# EAGLE design mapleCUx_large_400-001 (EAGLE 9.3.0)
MAPLE-CUx Large Version
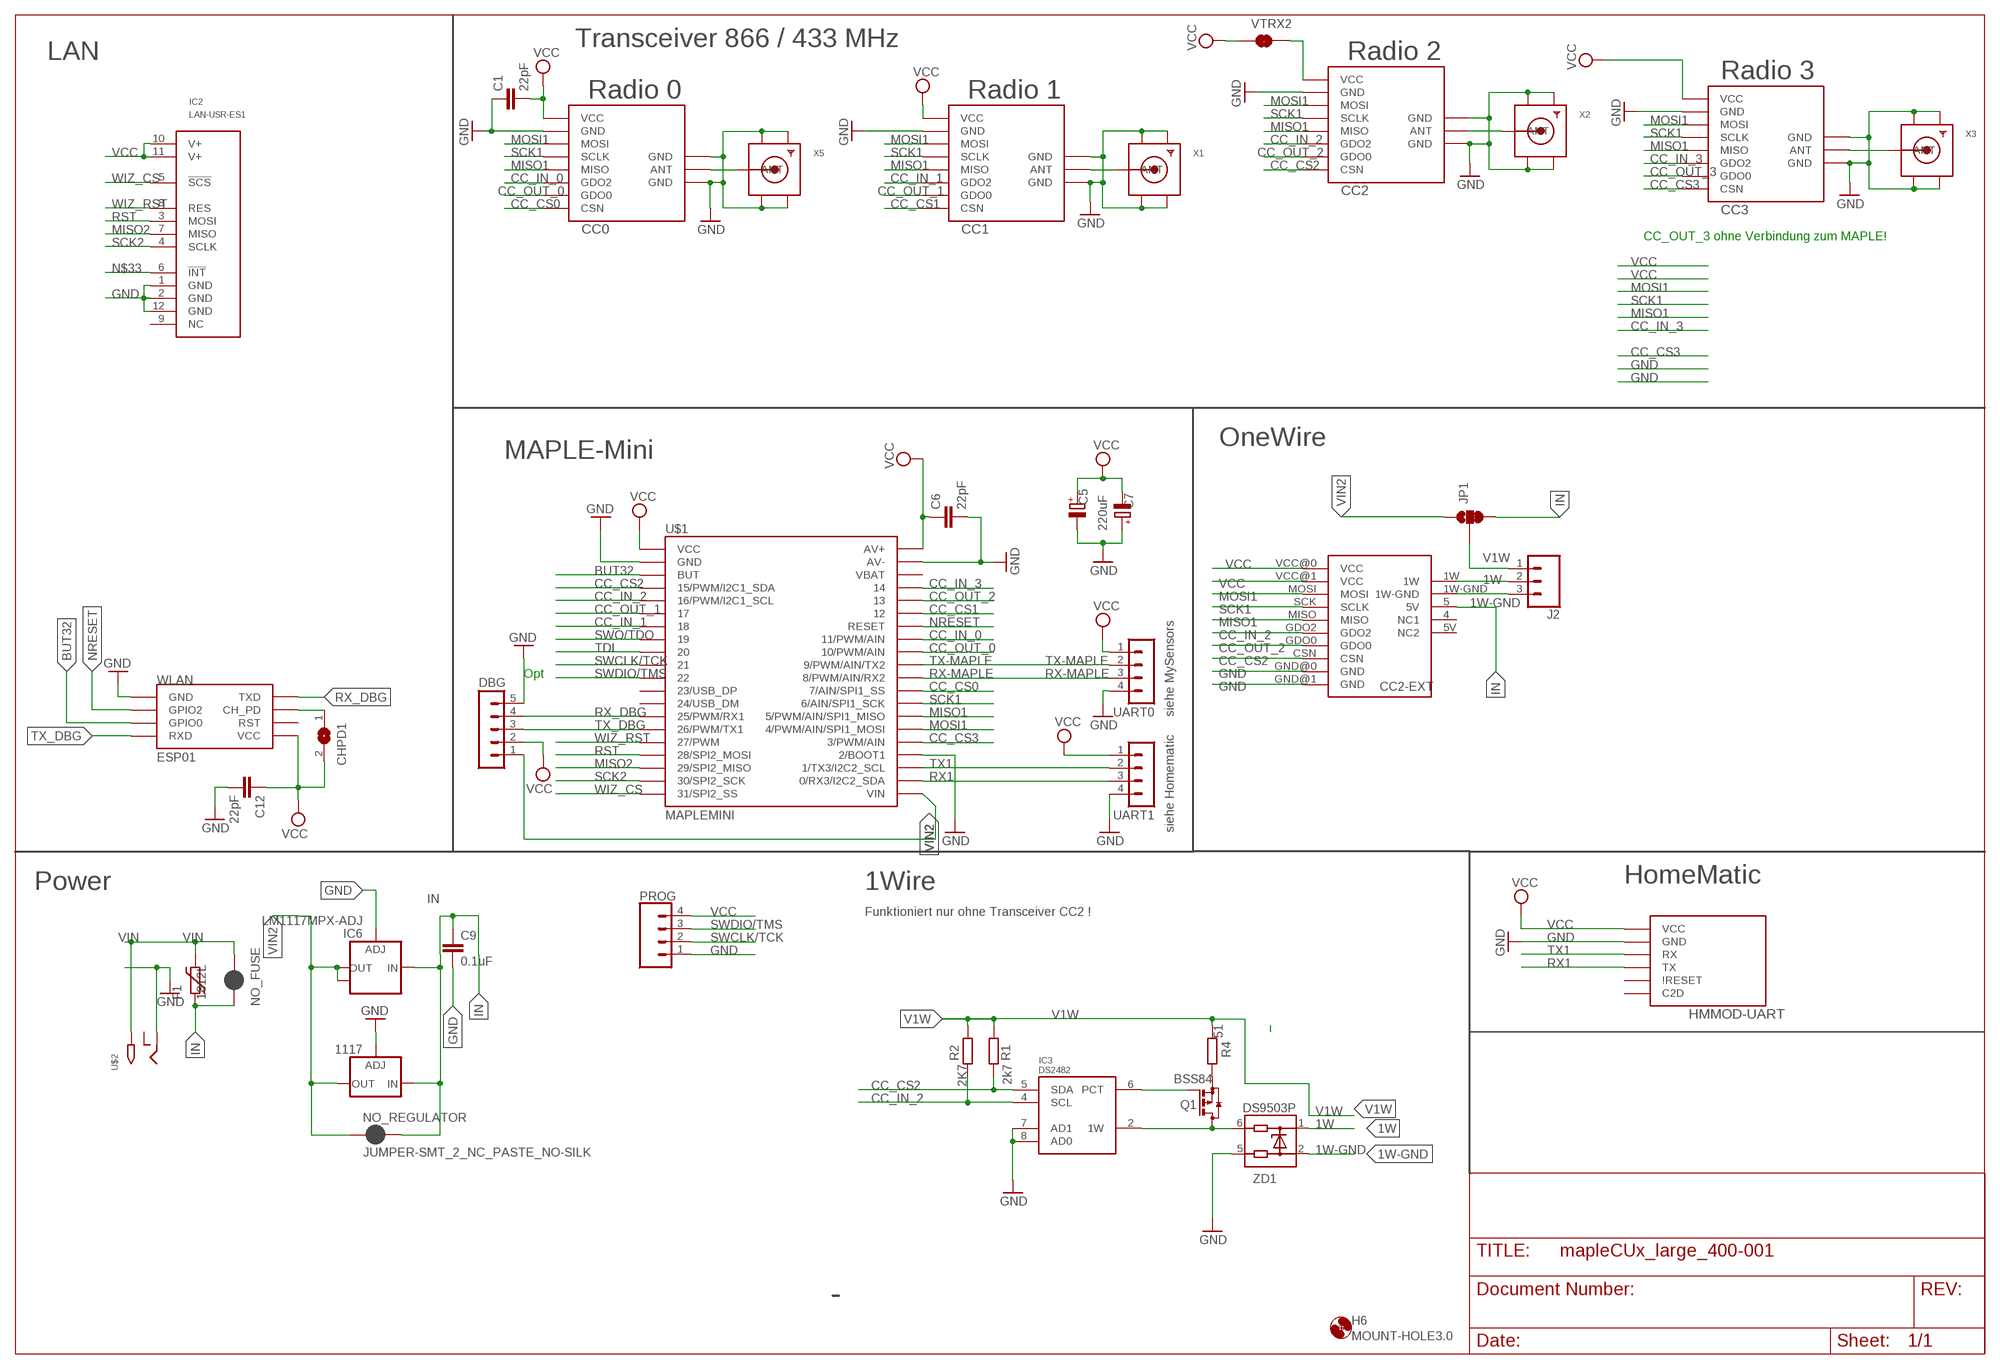
[diagram p0: schematic, sheet 1]

## Parts
1117  LD117ADT50TR  [DPACK]
C1  22pF  C-EUC0805  [C0805]
C5  220uF  CPOL-EUE5-8.5  [E5-8,5]
C6  22pF  C-EUC0805  [C0805]
C7  CPOL-EUSMCE  [SMC_E]
C9  0.1uF  C-EUC1206  [C1206]
C12  22pF  C-EUC0805  [C0805]
CC0  CC1101  CC1101_MODULE1SMD  [CC1101_MODULE1_SMD]
CC1  CC1101_MODULE1SMD  [CC1101_MODULE1_SMD]
CC2  CC1101_MODULE1SMD  [CC1101_MODULE1_SMD]
CC2-EXT  ONEWIRE-MODULE  [ONEWIRE_CC1101_MODULE3_DIL]
CC3  CC1101_MODULE1SMD  [CC1101_MODULE1_SMD]
CHPD1  SJ  [SJ]
DBG  MA05-1  [MA05-1]
F1  1812L  [1812L]
H6  MOUNT-HOLE3.0  [3,0]
HMMOD-UART  HM-MOD-UARTDIL  [HM-MOD-UART-DIL]
IC2  LAN-USR-ES1  [USR-ES1]
IC3  DS2482  DS2482-100S  [SO08]
IC6  LM1117MPX-ADJ  [SOT223]
J2  CONN_03LONGPADS  [1X03_LONGPADS]
JP1  JUMPER-SMT_3_1-NC_TRACE_SILK  [SMT-JUMPER_3_1-NC_TRACE_SILK]
NO_FUSE  JUMPER-SMT_2_NC_PASTE_NO-SILK  [SMT-JUMPER_2_NC_PASTE_NO-SILK]
NO_REGULATOR  JUMPER-SMT_2_NC_PASTE_NO-SILK  [SMT-JUMPER_2_NC_PASTE_NO-SILK]
PROG  CONN_04LOCK  [1X04_LOCK]
Q1  BSS84  [SOT23]
R1  2k7  R-EU_R0805  [R0805]
R2  2K7  R-EU_R0805  [R0805]
R4  51  R-EU_R0805  [R0805]
U$1  MAPLEMINI  [20-DIP]
U$2  2.1MMJACKTHM  [PJ-102A]
UART0  MA04-1  [MA04-1]
UART1  MA04-1  [MA04-1]
VTRX2  JUMPER-SMT_2_NC_TRACE_SILK  [SMT-JUMPER_2_NC_TRACE_SILK]
WLAN  ESP01  [ESP01]
X1  SMACONNECTOR_EDGE  [SMA_EDGELAUNCH]
X2  SMACONNECTOR_EDGE  [SMA_EDGELAUNCH]
X3  SMACONNECTOR_EDGE  [SMA_EDGELAUNCH]
X5  SMACONNECTOR_EDGE  [SMA_EDGELAUNCH]
ZD1  DS9503P  [TSOC6]

## Nets
1W: CC2-EXT.1W J2.2 ZD1.1
1W-GND: CC2-EXT.1W-GND J2.3 ZD1.2
ANT0: CC0.ANT X5.P(ANT)
ANT1: CC1.ANT X1.P(ANT)
ANT2: CC2.ANT X2.P(ANT)
ANT3: CC3.ANT X3.P(ANT)
BUT32: U$1.3(BUT) WLAN.GPIO0
CC_CS0: CC0.CSN U$1.29(7/AIN/SPI1_SS)
CC_CS1: CC1.CSN U$1.35
CC_CS2: CC2-EXT.CSN CC2.CSN IC3.5(SDA) R1.2 U$1.4(15/PWM/I2C1_SDA)
CC_CS3: CC3.CSN U$1.25(3/PWM/AIN)
CC_IN_0: CC0.GDO2 U$1.33(11/PWM/AIN)
CC_IN_1: CC1.GDO2 U$1.7
CC_IN_2: CC2-EXT.GDO2 CC2.GDO2 IC3.4(SCL) R2.2 U$1.5(16/PWM/I2C1_SCL)
CC_IN_3: CC3.GDO2 U$1.37
CC_OUT_0: CC0.GDO0 U$1.32(10/PWM/AIN)
CC_OUT_1: CC1.GDO0 U$1.6
CC_OUT_2: CC2-EXT.GDO0 CC2.GDO0 U$1.36
CC_OUT_3: CC3.GDO0
GND [Power]: 1117.1(ADJ) C1.1 C5.- C6.2 C7.+ C9.2 C12.2 CC0.GND@0(GND) CC0.GND@1(GND) CC0.GND@2(GND) CC1.GND@0(GND) CC1.GND@1(GND) CC1.GND@2(GND) CC2-EXT.GND@0(GND) CC2-EXT.GND@1(GND) CC2.GND@0(GND) CC2.GND@1(GND) CC2.GND@2(GND) CC3.GND@0(GND) CC3.GND@1(GND) CC3.GND@2(GND) DBG.5 HMMOD-UART.2(GND) IC2.1(GND) IC2.2(GND) IC2.12(GND) IC3.7(AD1) IC3.8(AD0) IC6.1(ADJ) PROG.1 U$1.2(GND) U$1.24(2/BOOT1) U$1.39(AV-) U$2.RING UART0.4 UART1.4 WLAN.GND X1.GND@1(GND4) X1.GND@2(GND3) X1.GND@3(GND2) X1.GND@4(GND1) X2.GND@1(GND4) X2.GND@2(GND3) X2.GND@3(GND2) X2.GND@4(GND1) X3.GND@1(GND4) X3.GND@2(GND3) X3.GND@3(GND2) X3.GND@4(GND1) X5.GND@1(GND4) X5.GND@2(GND3) X5.GND@3(GND2) X5.GND@4(GND1) ZD1.5
IN [Power]: 1117.3(IN) C9.1 CC2-EXT.5(5V) F1.P$1 IC6.3(IN) JP1.3 NO_FUSE.1 NO_REGULATOR.2
MISO1: CC0.MISO CC1.MISO CC2-EXT.MISO CC2.MISO CC3.MISO U$1.27(5/PWM/AIN/SPI1_MISO)
MISO2: IC2.7(MISO) U$1.18(29/SPI2_MISO)
MOSI1: CC0.MOSI CC1.MOSI CC2-EXT.MOSI CC2.MOSI CC3.MOSI U$1.26(4/PWM/AIN/SPI1_MOSI)
N$1 [Power]: CC2.VCC VTRX2.2
N$2: CHPD1.1 WLAN.CH_PD
N$33: IC2.6(!INT!)
N$47: IC3.6(PCT) Q1.1(G)
N$48: IC3.2(1W) Q1.3(D) ZD1.6
N$52: Q1.2(S) R4.1
NRESET: U$1.34(RESET) WLAN.GPIO2
RST: IC2.3(MOSI) U$1.17(28/SPI2_MOSI)
RX1: HMMOD-UART.5(TX) U$1.22(0/RX3/I2C2_SDA) UART1.3
RX-MAPLE: U$1.30(8/PWM/AIN/RX2) UART0.3
RX_DBG: DBG.4 U$1.14(25/PWM/RX1) WLAN.TX(TXD)
SCK1: CC0.SCLK CC1.SCLK CC2-EXT.SCK(SCLK) CC2.SCLK CC3.SCLK U$1.28(6/AIN/SPI1_SCK)
SCK2: IC2.4(SCLK) U$1.19(30/SPI2_SCK)
SWCLK/TCK: PROG.2 U$1.10
SWDIO/TMS: PROG.3 U$1.11
SWO/TDO: U$1.8
TDI: U$1.9
TX1: HMMOD-UART.6(RX) U$1.23(1/TX3/I2C2_SCL) UART1.2
TX-MAPLE: U$1.31(9/PWM/AIN/TX2) UART0.2
TX_DBG: DBG.3 U$1.15(26/PWM/TX1) WLAN.RX(RXD)
V1W [Power]: J2.1 JP1.2 R1.1 R2.1 R4.2
VCC [Power]: C1.2 C5.+ C6.1 C7.- C12.1 CC0.VCC CC1.VCC CC2-EXT.VCC@0(VCC) CC2-EXT.VCC@1(VCC) CC3.VCC CHPD1.2 DBG.2 HMMOD-UART.1(VCC) IC2.10(V+) IC2.11(V+) PROG.4 U$1.1(VCC) U$1.40(AV+) UART0.1 UART1.1 VTRX2.1 WLAN.VCC
VIN [Power]: F1.P$2 NO_FUSE.2 U$2.TIP
VIN2 [Power]: 1117.4(OUT) DBG.1 IC6.2(OUT) IC6.TAB(OUT1) JP1.1 NO_REGULATOR.1 U$1.21(VIN)
WIZ_CS: IC2.5(!SCS!) U$1.20(31/SPI2_SS)
WIZ_RST: IC2.8(RES) U$1.16(27/PWM)
Unconnected: CC2-EXT.4(NC1) CC2-EXT.5V(NC2) HMMOD-UART.3(C2D) HMMOD-UART.4(\!RESET) IC2.9(NC) U$1.12(23/USB_DP) U$1.13(24/USB_DM) U$1.38(VBAT) U$2.RING_SW WLAN.RST

## Notes on the sheet
- Transceiver 866 / 433 MHz
- LAN | Radio 2
- Radio 3
- Radio 0 | Radio 1
- CC_OUT_3 ohne Verbindung zum MAPLE!
- OneWire
- MAPLE-Mini
- Opt
- siehe MySensors
- siehe Homematic
- Power | 1Wire | HomeMatic
- Funktioniert nur ohne Transceiver CC2 !

## Power pins joined to a net without a drawn wire
GND: IC3.3(GND)
V1W: IC3.1(VDD)

## Library data of the parts
1117 = v-reg:LD117A?*: Low drop fixed and adjustable positive voltage regulators 1 A Source: http://www.st.com/stonline/products/literature/ds/7194/ld1117axx.pdf
C1 C6 C9 C12 = rcl:C-EU: CAPACITOR, European symbol
C5 = rcl:CPOL-EU: POLARIZED CAPACITOR, European symbol
C7 = rcl:CPOL-EU: POLARIZED CAPACITOR, European symbol; SPICEPREFIX: C
CC0 CC1-CC3 = wireless:CC1101_MODULE1: CC1101 wireless module for 433/868 MHz (sold from Aliexpress). DIL version for mounting with pin header (and SMD soldering) and SMD only variant available.
CC2-EXT = CC1101:ONEWIRE-MODULE
CHPD1 = jumper:SJ: SMD solder JUMPER
DBG = con-lstb:MA05-1: PIN HEADER; OC_FARNELL: unknown; OC_NEWARK: unknown
F1 = ptc-littlefuse:1812L
H6 = holes:MOUNT-HOLE: MOUNTING HOLE with drill center marker
HMMOD-UART = wireless:HM-MOD-UART: eQ3 HM-MOD-UART-AW-SH2 wireless module for 868 MHz. DIL version for mounting with pin header (antenna upwards) and SMD variant available (antenna downwards).
IC2 = Martin-Communication:LAN-USR-ES1
IC3 = 1wire:DS2482-100: I2C to 1-Wire Host Adapter/Line Driver This device is a onewire host and I2C interface in one chip. It provides the complete DC/AC requirements for onewire communication, including overdrive speed mode, but, unlike the DS2480B chip, no 12V EPROM programming. Notes: For overdrive speed and 5V EEPROM programming, an external active pullup circuit must be connected to the 1W, VDD and PCT pin. See the datasheet for details. The lower two I2C adress bits of the chip can be selected by external pins, so up to 4 chips may be connected to the same I2C bus. Author: Orginal device and description from Giovanni Varasano <giovanni.varasano@fastwebnet.it> Improved by Jan Kandziora <jjj@gmx.de>
IC6 = lm1117:LM1117MPX-ADJ
J2 = SparkFun-Connectors:CONN_03: Multi connection point. Often used as Generic Header-pin footprint for 0.1 inch spaced/style header connections On any of the 0.1 inch spaced packages, you can populate with these: Break Away Headers - Straight <https://www.sparkfun.com/products/116> (PRT-00116) Break Away Male Headers - Right Angle <https://www.sparkfun.com/products/553> (PRT-00553) Female Headers <https://www.sparkfun.com/products/115> (PRT-00115) Break Away Headers - Machine Pin <https://www.sparkfun.com/products/117> (PRT-00117) Break Away Female Headers - Swiss Machine Pin <https://www.sparkfun.com/products/743> (PRT-00743) Stackable Header - 3 Pin (Female, 0.1") <https://www.sparkfun.com/products/13875> (PRT-13875) For SCREWTERMINALS and SPRING TERMINALS visit here: Screw Terimnals on SparkFun.com <https://www.sparkfun.com/search/results?term=Screw+Terminals> (5mm/3.5mm/2.54mm spacing) This device is also useful as a general connection point to wire up your design to another part of your project. Our various solder wires solder well into these plated through hole pads. Hook-Up Wire - Assortment (Stranded, 22 AWG) <https://www.sparkfun.com/products/11375> (PRT-11375) Hook-Up Wire - Assortment (Solid Core, 22 AWG) <https://www.sparkfun.com/products/11367> (PRT-11367) View the entire wire category on our website here <https://www.sparkfun.com/categories/141> Special notes: Molex polarized connector foot print use with SKU : PRT-08232 with associated crimp pins and housings.
JP1 = SparkFun-Jumpers:JUMPER-SMT_3_1-NC_TRACE: Normally closed trace jumper (1 of 2 connections) This jumper has a trace between two pads so it's normally closed (NC). The other connection is normally open (NO). Use a razor knife to open the connection. For best results follow the IPC guidelines for cutting traces: Cutout at least 0.063 mm (0.005 in). Remove all loose material to clean up the cut area. Seal the cut with an approved epoxy. Reapply solder to reclose the connection, or to close the NO connection.
NO_FUSE NO_REGULATOR = SparkFun-Jumpers:JUMPER-SMT_2_NC_PASTE: Normally closed solder jumper This jumper has an aperture in the stencil to allow solder paste to bridge the split in the wire so it's normally closed (NC). Wick off the solder to open the connection. Reapply solder to reclose the connection.
PROG = SparkFun-Connectors:CONN_04: Multi connection point. Often used as Generic Header-pin footprint for 0.1 inch spaced/style header connections On any of the 0.1 inch spaced packages, you can populate with these: Break Away Headers - Straight <https://www.sparkfun.com/products/116> (PRT-00116) Break Away Male Headers - Right Angle <https://www.sparkfun.com/products/553> (PRT-00553) Female Headers <https://www.sparkfun.com/products/115> (PRT-00115) Break Away Headers - Machine Pin <https://www.sparkfun.com/products/117> (PRT-00117) Break Away Female Headers - Swiss Machine Pin <https://www.sparkfun.com/products/743> (PRT-00743) For SCREWTERMINALS and SPRING TERMINALS visit here: Screw Terimnals on SparkFun.com <https://www.sparkfun.com/search/results?term=Screw+Terminals> (5mm/3.5mm/2.54mm spacing) This device is also useful as a general connection point to wire up your design to another part of your project. Our various solder wires solder well into these plated through hole pads. Hook-Up Wire - Assortment (Stranded, 22 AWG) <https://www.sparkfun.com/products/11375> (PRT-11375) Hook-Up Wire - Assortment (Solid Core, 22 AWG) <https://www.sparkfun.com/products/11367> (PRT-11367) View the entire wire category on our website here <https://www.sparkfun.com/categories/141> Special notes: Molex polarized connector foot print use with SKU : PRT-08231 with associated crimp pins and housings. 1MM SMD Version SKU: PRT-10208; PROD_ID: CONN-09696
Q1 = transistor-small-signal:BSS84: P-CHANNEL MOS FET
R1 R2 R4 = rcl:R-EU_: RESISTOR, European symbol
U$1 = maplemini-small:MAPLEMINI
U$2 = adafruit:2.1MMJACK: 2.1mm x 5.5mm THM DC jack with internal switch. Digikey part #PJ-102A, 4UCON part #05537 2.1mm x 5.5mm SMT DC jack with internal switch. Digikey part #PJ-002A-SMT, 4UCON part #03267 By microbuilder.eu & adafruit.com
UART0 UART1 = con-lstb:MA04-1: PIN HEADER; OC_FARNELL: unknown; OC_NEWARK: unknown
VTRX2 = SparkFun-Jumpers:JUMPER-SMT_2_NC_TRACE: Normally closed trace jumper This jumper has a trace between two pads so it's normally closed (NC). Use a razor knife to open the connection. For best results follow the IPC guidelines for cutting traces: Cutout at least 0.063 mm (0.005 in). Remove all loose material to clean up the cut area. Seal the cut with an approved epoxy. Reapply solder to reclose the connection.
WLAN = esp8266modules:ESP01: ESP8266 Wifi module 01
X1-X3 X5 = adafruit:SMACONNECTOR: SMA Connector 90° DIP SMA Connector, 50 Ohm (4UConnector: 07259)
ZD1 = 1wire:DS9503: ESD Protection Diode with Resistors This ESD protection diode is designed especially for onewire host interfaces. Unlike the DS9502, it has two additional 5Ohm resitors in the 1W and GND line. Pin 5 and 6 have to be connected to the host side, pin 1 und 2 to the network side. The 1W line is through pin 1 and 6, the GND line is through pin 2 and 5. Author: Jan Kandziora <jjj@gmx.de>

## Net classes
0 default: width 0.305 mm
1 Power: width 0.61 mm

## Board
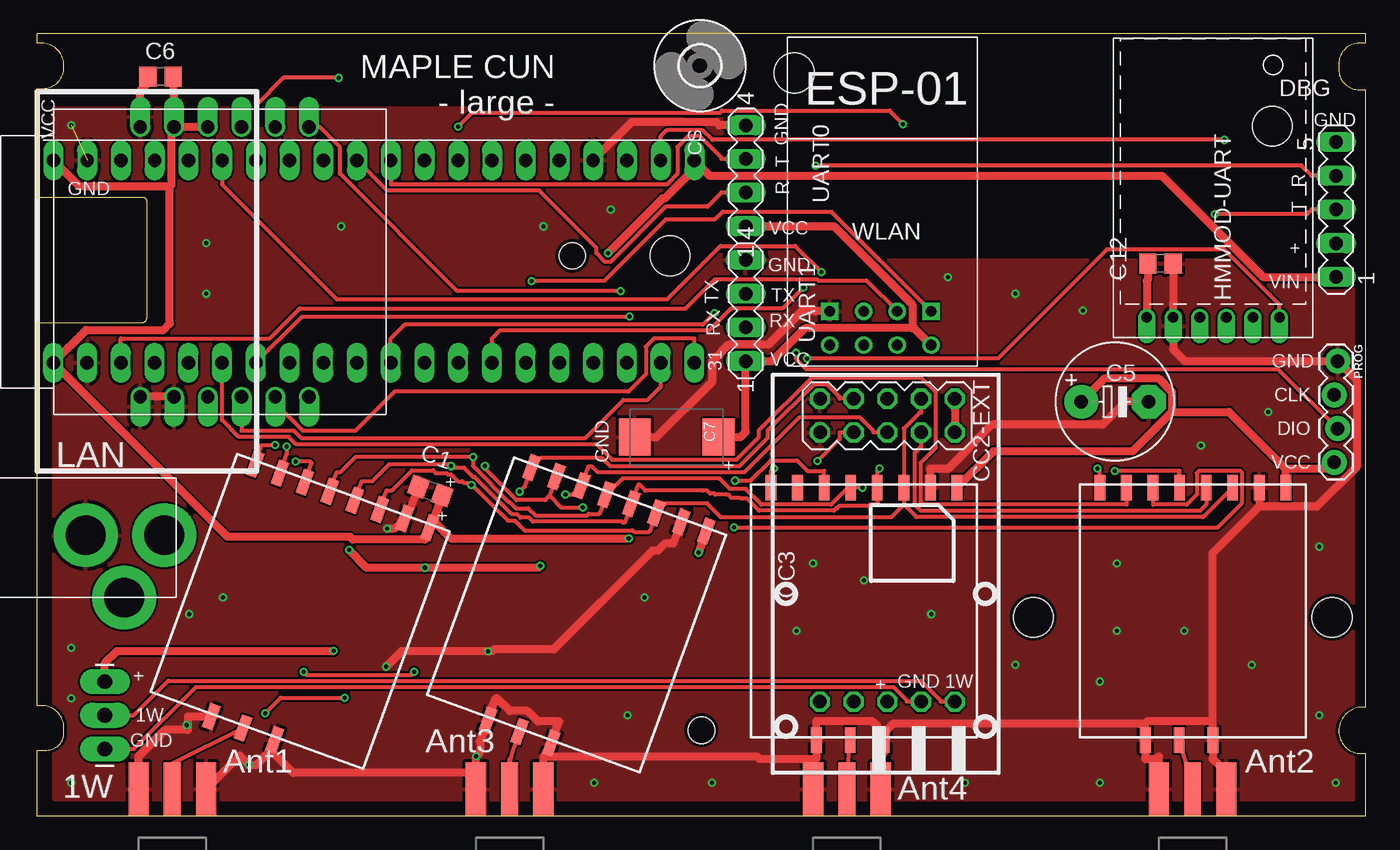
[diagram p1: board, top side]
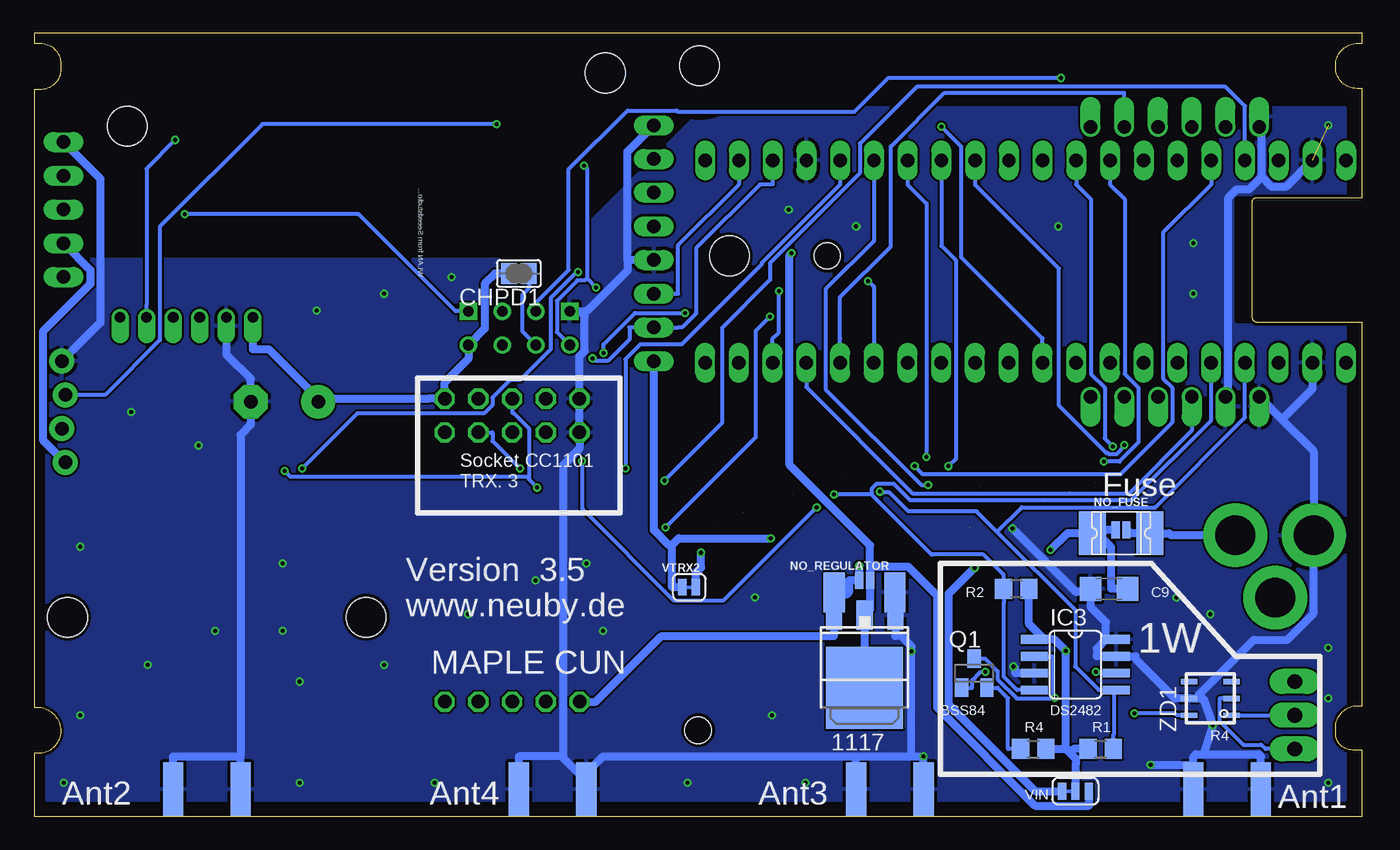
[diagram p2: board, bottom side, seen from below]

Size 100 x 59 mm. Coordinates in mm from the lower left corner, seen from the top.
Outline: 0,0 0,5 0.71,5 arc90 2,6.29 2,6.67 arc90 0.32,8.35 0,8.35 0,37.21 7.89,37.21 arc90 8.26,37.58 8.26,46.32 arc90 7.97,46.61 0,46.61 0,54.83 0.39,54.83 arc90 2,56.44 2,56.57 arc90 0.33,58.24 0,58.24 0,59 100,59 100,58.24 99.54,58.24 arc90 98,56.7 98,56.41 arc90 99.41,54.75 100,54.75 100,8.24 99.8,8.24 arc90 98,6.44 arc90 99.69,4.75 100,4.75 100,0 0,0
Copper layers (1*16): Top 0.035mm / dielectric 1.5mm / Bottom 0.035mm
Design rules "SeeedStudio_2layer_DRU_no_angle_20140221": minimum track width 6mil, minimum drill 12mil, track to track 6mil, track to pad 6mil, pad to pad 6mil, via to via 6mil, smd to smd 0mil, copper to edge 10mil, drill to drill 10mil, minimum pad ring 10mil, minimum via ring 6mil, stop-mask expansion 2mil, vias tented up to drill 100mil, thermal gap 10mil
Holes 2 mm at 50,6.5 40.28,42.23
Holes 3 mm at 47.65,42.23 93,52 57,56 75,15 97.5,15
tRestrict: area 0,37.3 to 9.4,46.5
bRestrict: area 0,37.3 to 9.4,46.5

### Footprints (pad centres in the part's own frame; a part is rotated, then mirrored left to right if it is on the bottom)
DPACK = smd 1.6 x 3: 1 -2.28,-4.8; 3 2.28,-4.8 | smd 5.8 x 6.2: 4 0,2.38
C0805 = smd 1.3 x 1.5: 1 -0.95,0; 2 0.95,0
E5-8,5 = drill 1.016 pad 2.54: + -2.54,0 | drill 1.016 pad 2.54 octagon: - 2.54,0
SMC_E = smd 2.4 x 2.8: + -3.15,0; - 3.15,0
C1206 = smd 1.6 x 1.8: 1 -1.4,0; 2 1.4,0
CC1101_MODULE1_SMD = smd 1.93 x 0.813: ANT 19,5.96; CSN 0,0; GDO0 0,2; GDO2 0,4; GND@0 0,12; GND@1 19,8.5; GND@2 19,3.42; MISO 0,6; MOSI 0,10; SCLK 0,8; VCC 0,14
ONEWIRE_CC1101_MODULE3_DIL = drill 1.016 octagon: 1W 24.638,13.716; 1W-GND 24.638,11.176; 4 24.638,6.096; 5 24.638,3.556; 5V 24.638,8.636; CSN 1.81,6.1; GDO0 4.35,6.1; GDO2 4.35,8.64; GND@0 1.81,3.56; GND@1 4.35,3.56; MISO 1.81,8.64; MOSI 1.81,11.18; SCK 4.35,11.18; VCC@0 1.81,13.72; VCC@1 4.35,13.72
SJ = smd 1.168 x 1.6: 1 -0.762,0; 2 0.762,0
MA05-1 = drill 1.016 long: 1 -5.08,0; 2 -2.54,0; 3 0,0; 4 2.54,0; 5 5.08,0
1812L = smd 2.03 x 3.3: P$1 -2.16,0; P$2 2.16,0
3,0 = hole 3: 0,0
HM-MOD-UART-DIL = drill 0.8 offset: 1 0,12; 2 0,10; 3 0,8; 4 0,6; 5 0,4; 6 0,2
USR-ES1 = drill 1 pad 1.35 offset: 1 -10.16,5.715; 2 -10.16,3.175; 3 -10.16,0.635; 4 -10.16,-1.905; 5 -10.16,-4.445; 6 -10.16,-6.985; 7 10.16,-6.985; 8 10.16,-4.445; 9 10.16,-1.905; 10 10.16,0.635; 11 10.16,3.175; 12 10.16,5.715
SO08 = smd 0.66 x 2.032: 1 -1.905,-3.073; 2 -0.635,-3.073; 3 0.635,-3.073; 4 1.905,-3.073; 5 1.905,3.073; 6 0.635,3.073; 7 -0.635,3.073; 8 -1.905,3.073
SOT223 = smd 1.219 x 2.235: 1 -2.311,-3.099; 2 0,-3.099; 3 2.311,-3.099 | smd 3.6 x 2.2: TAB 0,3.099
1X03_LONGPADS = drill 1.118 pad 1.88 long: 1 0,0; 2 2.54,0; 3 5.08,0
SMT-JUMPER_3_1-NC_TRACE_SILK = smd 0.635 x 1.27: 1 -1.016,0; 2 0,0; 3 1.016,0
SMT-JUMPER_2_NC_PASTE_NO-SILK = smd 0.635 x 1.27: 1 -0.406,0; 2 0.406,0
1X04_LOCK = drill 1.016 pad 1.88: 1 0,0.127; 2 2.54,-0.127; 3 5.08,0.127; 4 7.62,-0.127
SOT23 = smd 1 x 1.4: 1 -0.95,-1.1; 2 0.95,-1.1; 3 0,1.1
R0805 = smd 1.3 x 1.5: 1 -0.95,0; 2 0.95,0
20-DIP = drill 1.016 pad 1.27 long: 1 -24.13,-7.62; 2 -21.59,-7.62; 3 -19.05,-7.62; 4 -16.51,-7.62; 5 -13.97,-7.62; 6 -11.43,-7.62; 7 -8.89,-7.62; 8 -6.35,-7.62; 9 -3.81,-7.62; 10 -1.27,-7.62; 11 1.27,-7.62; 12 3.81,-7.62; 13 6.35,-7.62; 14 8.89,-7.62; 15 11.43,-7.62; 16 13.97,-7.62; 17 16.51,-7.62; 18 19.05,-7.62; 19 21.59,-7.62; 20 24.13,-7.62 | drill 1 pad 1.27 long: 21 24.13,7.62; 22 21.59,7.62; 23 19.05,7.62; 24 16.51,7.62; 25 13.97,7.62; 26 11.43,7.62; 27 8.89,7.62; 28 6.35,7.62; 29 3.81,7.62; 30 1.27,7.62; 31 -1.27,7.62; 32 -3.81,7.62; 33 -6.35,7.62; 34 -8.89,7.62; 35 -11.43,7.62; 36 -13.97,7.62; 37 -16.51,7.62; 38 -19.05,7.62; 39 -21.59,7.62; 40 -24.13,7.62
PJ-102A = drill 3 pad 4.8: RING 0.1,-3.39; RING_SW -4.6,-6.29; TIP 0.1,-9.29
MA04-1 = drill 1.016 long: 1 -3.81,0; 2 -1.27,0; 3 1.27,0; 4 3.81,0
SMT-JUMPER_2_NC_TRACE_SILK = smd 0.635 x 1.27: 1 -0.508,0; 2 0.508,0
ESP01 = drill 0.8: CH_PD -1.285,-8.178; GPIO0 1.255,-5.638; GPIO2 -1.285,-5.638; RST 1.255,-8.178; TX -3.825,-8.178; VCC 3.795,-8.178 | drill 0.8 square: GND -3.825,-5.638; RX 3.795,-5.638
SMA_EDGELAUNCH = smd 4.064 x 1.524: GND@1 2.032,-2.54; GND@2 2.032,2.54 | smd 4.064 x 1.524 bottom: GND@3 2.032,2.54; GND@4 2.032,-2.54 | smd 4.064 x 1.27: P 2.032,0
TSOC6 = smd 0.406 x 1.219: 1 -1.27,-1.6; 2 0,-1.6; 3 1.27,-1.6; 4 1.27,1.6; 5 0,1.6; 6 -1.27,1.6

### Placement (x,y rotation side)
1117  37.47,12.06 180 bottom
C1  29.59,24.51 340 top
C5  81.15,31.24 0 top
C6  9.27,55.74 180 top
C7  48.13,28.57 0 top
C9  19.05,17.14 180 bottom
C12  84.58,41.66 0 top
CC0  16.38,26.54 250 top
CC1  80.01,24.77 270 top
CC2  37.21,26.29 250 top
CC2-EXT  55.37,33.27 270 top
CC3  55.24,24.77 270 top
CHPD1  63.5,40.89 180 bottom
DBG  97.79,45.72 90 top
F1  18.16,21.34 0 bottom
H6  49.89,56.55 0 top
HMMOD-UART  95.54,37.59 90 top
IC2  13.46,41.78 90 top
IC3  21.59,11.43 270 bottom
IC6  37.47,12.06 180 bottom
J2  5.08,10.16 270 top
JP1  21.59,1.91 180 bottom
NO_FUSE  18.16,21.59 0 bottom
NO_REGULATOR  37.47,17.78 180 bottom
PROG  97.79,34.29 270 top
Q1  29.21,10.79 0 bottom
R1  19.68,5.08 0 bottom
R2  26.04,17.14 180 bottom
R4  24.77,5.08 0 bottom
U$1  25.34,41.8 0 top
U$2  0.25,21.08 90 top
UART0  53.34,48.26 90 top
UART1  53.34,38.1 90 top
VTRX2  50.67,17.27 0 bottom
WLAN  63.5,43.69 0 top
X1  87,0 90 top
X2  35.56,0 90 top
X3  60.96,0 90 top
X5  10.16,0 90 top
ZD1  11.43,8.89 90 bottom

### Tracks (layer width: path | path; a pad name or v marks a point on that pad's centre or on a via)
1W
  Top 0.305: CC2-EXT.1W 68.02,8.64 68.02,8.75 66.55,10.22 9.86,10.22 7.26,7.62 J2.2
  Bottom 0.305: ZD1.1 J2.2
1W-GND
  Top 0.305: CC2-EXT.1W-GND 65.48,8.64 65.48,8.75 64.47,9.76 11.95,9.76 7.26,5.08 J2.3
  Bottom 0.305: J2.3 7.26,5.08 7.6,5.42 8.94,5.42 10.74,7.22 10.74,8.89 ZD1.2
ANT0
  Top 0.305: 10.67,3.94 10.26,2.39 | 10.26,2.39 X5.P | CC0.ANT 10.03,3.94 10.26,2.39
ANT1
  Top 0.305: CC1.ANT 86.23,4.83 86.61,3.68 X1.P
ANT2  (1 unrouted)
  Top 0.305: CC2.ANT 35.79,4.96 35.56,4.06 | X2.P 35.56,4.06 | 35.56,4.06 35.56,4.37
ANT3
  Top 0.305: CC3.ANT 60.96,3.43 X3.P
BUT32
  Top 0.305: WLAN.GPIO0 62.42,40.38 58.79,40.38 58.7,40.47 51.01,40.47 48.8,38.26 19.75,38.26 17.5,36.01 6.29,36.01 U$1.3
CC_CS0  (via drill 0.3 pad 0.61)
  Top 0.305: v17.89,27.98 16.91,27.98 CC0.CSN
  Bottom 0.305: v17.89,27.98 17.89,27.89 18.52,27.27 19.03,27.27 19.13,27.36 19.25,27.36 22.82,30.94 22.82,41.28 29.15,47.61 U$1.29
CC_CS1  (via drill 0.3 pad 0.61)
  Top 0.305: v59.04,40.99 57.05,42.98 51.45,42.98 47.45,38.97 22.54,38.97 13.91,47.61 U$1.35 | CC1.CSN 80.01,26.04 79.99,26.04 v79.81,26.21
  Bottom 0.305: v59.04,40.99 59.16,40.99 61.1,39.05 61.1,35.19 63.41,32.88 64.14,32.88 65.48,31.54 65.48,31.01 66.14,30.36 75.67,30.36 v79.81,26.21
CC_CS2  (via drill 0.3 pad 0.61)
  Top 0.305: v36.3,24.46 v36.3,24.47 36.69,24.85 | 36.69,24.85 | 36.69,24.85 CC2.CSN 37.91,26.99 42.54,26.99 43.15,26.37 52.84,26.37 54.99,28.52 54.99,29.06 58.48,32.55 59.46,32.55 60.41,31.6 60.41,31.46 CC2-EXT.CSN
  Bottom 0.305: R1.2 18.73,6.13 18.7,6.17 18.7,9.53 | 18.7,9.53 19.84,9.53 21.6,11.29 21.6,15.55 27.48,21.43 | IC3.5 18.7,9.53 | 27.48,21.43 29.04,22.98 34.17,22.98 35.58,24.39 36.03,24.39 36.1,24.46 v36.3,24.46 | 27.48,21.43 25.63,23.29 15.59,23.29 8.83,30.05 U$1.4
CC_CS3  (via drill 0.3 pad 0.61)
  Top 0.305: v55.48,26.2 55.41,26.2 55.24,26.04 CC3.CSN
  Bottom 0.305: v55.48,26.2 55.48,34.44 54.36,35.56 51.25,35.56 45.19,41.61 45.19,41.72 39.31,47.61 U$1.25
CC_IN_0  (via drill 0.3 pad 0.61)  (1 unrouted)
  Top 0.305: 20.66,26.61 | 20.66,26.61 20.54,26.73 v19.44,26.73 | CC0.GDO2 20.66,26.61
  Bottom 0.305: U$1.33 18.99,47.61 17.88,46.5 17.88,33.34 16.83,32.29 16.83,28.18 18.28,26.73 v19.44,26.73
CC_IN_1  (via drill 0.3 pad 0.61)
  Top 0.305: v52.45,21.78 88.88,21.78 90.72,23.62 90.72,25.88 90.57,26.04 87.48,26.04 87.3,25.86 87.3,24.24 86.55,23.5 84.01,23.5 CC1.GDO2 | U$1.7 19.92,37.65 v44.6,37.65
  Bottom 0.305: v52.45,21.78 45.66,28.57 45.66,36.59 v44.6,37.65
CC_IN_2  (via drill 0.3 pad 0.61)  (1 unrouted)
  Top 0.305: v39.76,24.24 40.29,24.24 CC2.GDO2 41.49,26.36 41.78,26.36 42.22,25.92 53.21,25.92 57.33,30.04 61.94,30.04 62.95,29.04 62.95,28.92 CC2-EXT.GDO2
  Bottom 0.305: 36.91,24.24 36.91,24.72 36.55,25.07 35.28,25.07 34.04,23.83 17.37,23.83 11.37,29.84 U$1.5 | 36.91,24.24 36.91,24.21 32.43,19.73 28.51,19.73 26.98,18.2 R2.2 26.98,17.11 26.98,16.09 26.98,10.53 25.98,9.53 IC3.4 | 36.91,24.24 v39.76,24.24
CC_IN_3  (via drill 0.3 pad 0.61)
  Top 0.305: v52.55,25.29 53.7,25.29 55.23,26.82 57.2,26.82 57.98,26.04 59.24,26.04 CC3.GDO2
  Bottom 0.305: U$1.37 8.83,53.51 10.29,54.97 33.54,54.97 37.83,50.68 37.83,48.44 44.58,41.69 44.58,40.42 48.2,36.8 48.2,29.64 v52.55,25.29
CC_OUT_0  (via drill 0.3 pad 0.61)  (1 unrouted)
  Top 0.305: CC0.GDO0 18.79,27.3 | v18.78,27.88 18.78,27.3 18.79,27.3 | 18.79,27.3
  Bottom 0.305: U$1.32 21.53,47.61 20.42,46.5 20.42,33.34 19.39,32.31 19.39,28.48 v18.78,27.88
CC_OUT_1
  Top 0.305: U$1.6 13.91,29.86 15.16,28.6 18.93,28.6 19.5,28.03 42.15,28.03 43.3,26.87 52.62,26.87 54.3,28.56 54.3,29.06 58.28,33.04 66.58,33.04 67.66,31.96 67.66,27.79 66.53,26.66 66.53,23.67 66.71,23.5 82.01,23.5 CC1.GDO0
CC_OUT_2  (via drill 0.3 pad 0.61)  (1 unrouted)
  Top 0.305: 38.57,24.17 38.24,23.84 36.07,23.84 33.69,26.21 v33.69,26.39 | 38.57,24.17 39.45,23.29 v41.07,23.29 | 38.57,24.17 | v58.74,26.77 60.41,28.43 60.41,28.92 CC2-EXT.GDO0 | CC2.GDO0 38.57,24.17
  Bottom 0.305: v33.69,26.39 33.08,25.77 18.2,25.77 14.3,29.68 14.3,32.3 15,33 15,43.98 11.37,47.61 U$1.36 | v58.74,26.77 58.74,23.19 51.84,16.29 48.07,16.29 v41.07,23.29
GND  (via drill 0.3 pad 0.61)  (8 unrouted)
  Top 0.61: v26.26,11.29 27.41,12.44 v33.93,12.44 34.26,12.44 34.39,12.57 38.87,12.57 46.13,19.83 | 46.13,19.83 46.31,20.01 46.71,20.01 47.26,20.55 47.89,20.55 CC2.GND@0 | 46.13,19.83 | IC2.12 7.75,54.66 8.32,55.24 C6.2 | v26.34,21.71 26.93,21.71 CC0.GND@0 27.66,22.83 28.15,23.32 | 38.1,4.52 38.7,5.12 CC2.GND@1 39.29,7.16 37.69,7.16 36.89,7.95 35.58,7.95 34.63,8.9 34.52,8.9 CC2.GND@2 33.33,5.63 | 17.57,4.97 16.5,3.89 v15.93,3.89 15.24,4.57 X5.GND@4 | CC0.GND@2 11.33,7.52 11.33,6.52 | 17.57,4.97 | 33.02,3.28 19.26,3.28 17.57,4.97 | CC3.GND@0 67.25,26.19 68.56,26.19 71.88,29.52 80.24,29.52 81.97,31.24 C5.- | X5.GND@3 7.62,4.52 9.62,6.52 11.33,6.52 | 11.33,6.52 v11.26,6.88 | 58.42,4.34 58.66,4.34 CC3.GND@2 58.66,7.19 62.83,7.19 63.74,6.27 | 38.1,4.52 54.2,4.52 54.38,4.34 58.42,4.34 | 88.51,7.19 88.51,19.84 92.01,23.34 | 83.43,7 83.62,7.19 88.51,7.19 | CC1.GND@0 92.01,23.34 | 92.01,23.34 96.36,23.34 99.34,26.32 99.34,32.87 PROG.1 86.42,34.29 85.54,35.17 HMMOD-UART.2 85.54,38.7 85.53,38.71 C12.2 | 63.74,6.27 64.47,7 83.43,7 | 88.51,7.19 CC1.GND@1 88.51,4.34 89.53,3.32 X1.GND@4 | 83.43,7 CC1.GND@2 83.43,4.34 84.28,4.34 84.45,4.52 X1.GND@3 | 63.74,6.27 CC3.GND@1 63.74,4.77 63.5,4.52 X3.GND@4 | WLAN.GND 58.56,38.05 57.56,38.05 55.04,35.53 52.05,35.53 50.8,34.29 50.8,32.74 46.64,28.57 C7.+ | X3.GND@3 58.42,4.34 | 33.02,3.28 v33.02,4.52 33.33,4.83 33.33,5.63 | 33.33,5.63 | X2.GND@3 33.02,3.28 | CC0.GND@1 17.57,4.97 | UART0.4 51.36,52.07 51.13,52.3 44.73,52.3 U$1.24 | 28.15,23.32 | C1.1 28.15,23.32 | IC2.2 IC2.1 | X2.GND@1 38.1,4.52
  Bottom 0.61: IC3.3 26.14,10.79 26.14,11.17 v26.26,11.29 | 35.15,14.38 35.19,14.41 1117.1 | 35.15,14.38 35.15,13.59 34.71,13.59 33.93,12.81 v33.93,12.44 | IC6.1 35.15,14.38 | 33.93,4.52 v33.02,4.52 X2.GND@3 | 38.1,4.52 33.93,4.52 | 33.93,4.52 v33.93,12.44 | v33.93,12.44 | HMMOD-UART.2 85.54,34.81 83.69,32.97 C5.- 83.69,29.52 84.45,28.75 84.45,4.52 | 60.29,4.52 63.5,4.52 X3.GND@4 | 58.42,2.65 60.29,4.52 | 60.29,4.52 60.15,4.66 60.15,26.48 58.93,27.7 CC2-EXT.GND@1 CC2-EXT.GND@0 58.93,32.68 58.93,34.66 58.55,35.04 58.55,37.7 58.9,38.05 | 58.42,2.65 58.42,3.28 57.17,4.52 38.1,4.52 | X3.GND@3 58.42,2.65 | 11.96,4.69 v11.26,6.88 11.96,8.89 12.38,8.89 | 20.45,16.91 21.54,16.91 v26.34,21.71 | 55.32,41.91 55.32,41.11 58.38,38.05 58.56,38.05 58.9,38.05 | 20.45,16.91 20.45,16.68 20.45,16.47 20.45,15.79 19.28,14.62 19.28,13.34 | C9.2 20.45,16.91 | 19.28,13.34 19.99,12.63 19.99,12.06 IC3.7 17.04,12.06 17.04,11.84 14.1,8.89 ZD1.5 12.76,8.89 12.5,8.89 12.38,8.89 | 19.28,13.34 18.89,13.34 IC3.8 | v15.93,3.89 12.7,3.89 | 11.96,4.69 12.54,4.69 12.7,4.52 12.7,3.89 | 7.56,48.18 7.56,51.75 IC2.12 | IC2.2 10.06,31.85 10.06,46.63 9.45,47.24 8.5,47.24 7.56,48.18 | U$1.39 5.75,47.41 6.79,47.41 7.56,48.18 | 12.38,8.89 12.38,9.08 8.14,13.32 5.63,13.32 3.64,15.3 U$2.RING 3.64,27.52 6.03,29.91 | 11.96,4.69 7.79,4.69 7.62,4.52 X5.GND@3 | WLAN.GND 58.9,38.05 | 55.32,41.91 55.32,50.09 UART0.4 | 55.32,41.91 55.13,41.91 UART1.4 | X5.GND@4 12.7,3.89 | X1.GND@3 84.45,4.52 | X1.GND@4 89.53,4.52 84.45,4.52 | X2.GND@1 38.1,4.52 | DBG.5 95.02,48.03 95.02,37.19 PROG.1 | 6.03,29.91 IC2.1 | 6.03,29.91 3.75,32.2 U$1.2
  other vias: 2.54,52.07 12.7,43.18 12.7,39.37 22.86,44.45 13.97,16.51 11.43,15.24 2.54,12.7 2.54,2.54 2.54,8.89 41.91,2.54 50.8,2.54 44.45,7.62 45.72,16.51 57.15,13.97 58.42,19.05 62.23,17.78 67.31,15.24 73.66,11.43 80.01,10.16 81.28,13.97 81.28,19.05 78.74,38.1 73.66,39.37 68.58,40.64 92.71,30.48 87.63,27.94 86.36,13.97 91.44,11.43 96.52,7.62 97.79,2.54 80.01,2.54 69.85,2.54 96.52,20.32 43.18,45.72 38.1,44.45
  pour Top: 1.27,1.27 1.27,53.34 50.8,53.34 62.23,41.91 99.06,41.91 99.06,1.27
  pour Bottom: 1.27,1.27 1.27,53.34 49.53,53.34 60.96,41.91 99.06,41.91 99.06,1.27
IN  (via drill 0.3 pad 0.61)
  Top 0.61: v23.46,20.07 24.79,18.74 v29.18,18.74 37.74,18.74 v37.87,18.87
  Bottom 0.61: v23.46,20.07 22.19,21.34 21.79,21.34 F1.P$1 19.6,21.34 | v29.18,18.74 31.15,16.77 31.15,8.44 24.61,1.91 JP1.3 | 19.6,21.34 19.34,21.59 NO_FUSE.1 | 19.6,21.34 19.6,20.97 18.91,20.29 18.91,17.14 C9.1 | v37.87,18.87 NO_REGULATOR.2 38.65,17.78 38.65,16.88 38.67,16.86 | CC2-EXT.5 57.71,8.64 52.76,13.59 39.78,13.59 IC6.3 39.78,16.74 38.79,16.74 38.67,16.86 | 1117.3 38.67,16.86
MISO1  (via drill 0.3 pad 0.61)  (2 unrouted)
  Top 0.305: v81.14,26.04 86.01,26.04 CC1.MISO | v62.12,24.77 CC3.MISO 61.05,24.77 59.78,23.5 54.52,23.5 53.34,24.68 52.14,24.68 51.36,25.46 44.07,25.46 CC2.MISO 42.33,22.8 41.53,22.8 41.41,22.68 37.5,22.68 36.97,23.21 36.05,23.21 35.59,23.67 35.53,23.67 32.8,26.4 v32.8,27.09 23.97,27.09 22.81,25.93 22.54,25.93 CC0.MISO
  Bottom 0.305: 62.74,25.59 80.69,25.59 v81.14,26.04 | v32.8,27.09 32.8,46.18 34.23,47.61 U$1.27 | 62.74,25.59 62.74,25.39 v62.12,24.77 | 62.74,25.59 62.74,29.24 63.9,30.4 64.01,30.4 CC2-EXT.MISO
MISO2  (via drill 0.3 pad 0.61)
  Top 0.305: v43.92,39.58 31.62,39.58 22.8,48.41 22.8,50.41 21.27,51.94 IC2.7
  Bottom 0.305: U$1.18 44.39,36.01 43.92,36.47 v43.92,39.58 | v43.92,39.58
MOSI1  (via drill 0.3 pad 0.61)  (2 unrouted)
  Top 0.305: CC1.MOSI 87.8,22.55 66.19,22.55 65.25,23.5 | 65.25,23.5 64.28,22.53 51.47,22.53 50.43,23.58 47.32,23.58 CC2.MOSI 46.09,21.43 44.92,21.43 44.79,21.56 36.7,21.56 36.21,22.05 36.19,22.05 35.94,22.29 35.44,22.29 34.98,22.75 34.94,22.75 32.83,24.86 32.73,24.96 v32.68,24.96 32.53,25.1 32.15,25.1 32.01,25.24 31.67,25.24 31.14,25.77 30.9,25.77 30.8,25.87 30,25.87 29.8,26.07 28.21,26.07 26.7,24.56 26.3,24.56 CC0.MOSI | 65.25,23.5 CC3.MOSI 65.25,29.22 66.42,30.4 66.55,30.4 CC2-EXT.MOSI
  Bottom 0.305: U$1.26 36.77,43.34 40.4,39.71 40.4,32.17 33.19,24.96 v32.68,24.96
N$1  (via drill 0.3 pad 0.61)  (1 unrouted)
  Top 0.61: v49.77,19.87 | CC2.VCC v49.77,19.87
  Bottom 0.61: VTRX2.2 50.16,18.36 49.77,18.76 v49.77,19.87
N$2
  Bottom 0.305: CHPD1.1 62.74,39.79 63.21,39.31 63.21,36.51 WLAN.CH_PD
N$47  (via drill 0.3 pad 0.61)
  Top 0.305: v20.05,10.88 20.25,10.68 28.16,10.68 v28.37,10.88
  Bottom 0.305: v20.05,10.88 19.92,10.88 19.84,10.79 IC3.6 | v28.37,10.88 28.74,10.88 29.36,10.26 29.36,9.7 Q1.1
N$48  (via drill 0.3 pad 0.61)
  Top 0.305: v17.14,7.78 18.3,8.94 v23.12,8.94
  Bottom 0.305: 23.27,9.08 23.27,11.99 23.34,12.06 IC3.2 | 23.27,9.08 23.46,8.89 26,8.89 27.45,10.34 27.45,10.95 28.41,11.89 Q1.3 | 23.27,9.08 v23.12,8.94 | ZD1.6 13.95,7.62 14.1,7.78 v17.14,7.78
N$52
  Bottom 0.305: Q1.2 27.45,9.7 26.67,8.91 26.67,5.08 R4.1
NRESET  (via drill 0.3 pad 0.61)
  Top 0.305: v22.67,55.63 18.52,55.63 16.45,53.56 U$1.34
  Bottom 0.305: WLAN.GPIO2 62.22,38.7 59.75,41.16 59.75,48.74 55.31,53.18 51.6,53.18 51.49,53.07 38.25,53.07 35.69,55.63 v22.67,55.63
RST
  Bottom 0.305: U$1.17 41.85,32.35 33.81,24.31 17.57,24.31 12.83,29.06 IC2.3
RX1  (via drill 0.3 pad 0.61)
  Top 0.305: v89.37,50.96 50.82,50.96 50.09,51.69 47.38,51.69 46.93,51.23 U$1.22
  Bottom 0.305: U$1.22 46.93,47.61 51.51,43.02 51.51,39.37 UART1.3 | v89.37,50.96 91.54,48.8 91.54,38.55 HMMOD-UART.5
RX-MAPLE
  Top 0.305: U$1.30 26.61,47.61 47.4,47.61 48.2,48.4 48.2,50.43 48.99,51.23 49.91,51.23 51.51,49.63 51.51,49.53 UART0.3
RX_DBG  (via drill 0.3 pad 0.61)
  Top 0.305: U$1.14 34.23,36.01 34.8,36.58 50.56,36.58 52.24,38.26 56.1,38.26 v57.68,39.84 | v58.59,49.03 95.19,49.03 95.96,48.26 DBG.4
  Bottom 0.305: 58.38,40.54 58.54,40.38 59.08,40.38 60.63,38.83 60.63,36.47 WLAN.TX | 58.38,40.54 v57.68,39.84 | v58.59,49.03 58.38,48.83 58.38,40.54
SCK1  (via drill 0.3 pad 0.61)  (2 unrouted)
  Top 0.305: CC0.SCLK 24.42,25.24 25.22,25.24 26.5,26.52 31.01,26.52 v31.15,26.38 31.17,26.38 31.3,26.26 32.13,26.26 32.82,25.57 32.93,25.57 35.75,22.75 36.13,22.75 36.38,22.5 37.02,22.5 37.31,22.22 44.01,22.22 44.11,22.12 44.21,22.12 CC2.SCLK 45.25,24.99 45.34,24.99 45.79,24.54 50.11,24.54 | 50.11,24.54 50.44,24.54 50.66,24.32 50.98,24.32 51.05,24.25 51.92,24.25 51.95,24.22 52.05,24.22 52.26,24.01 52.84,24.01 52.89,23.96 53.08,23.96 53.08,23.95 53.42,23.95 54.33,23.04 59.97,23.04 60.16,23.23 60.22,23.23 60.35,23.37 62.57,23.37 62.7,23.5 63.24,23.5 63.24,24.13 CC3.SCLK 63.24,26.04 v63.42,26.21 | 50.11,24.54 | CC1.SCLK 88.01,23.5 87.55,23.03 66.53,23.03 66.08,23.48 66.08,27.38 66.55,27.86 CC2-EXT.SCK
  Bottom 0.305: U$1.28 31.69,42.98 30.6,41.89 30.6,26.93 v31.15,26.38 | v63.42,26.21 65.48,28.27 65.48,28.92 CC2-EXT.SCK
SCK2
  Top 0.305: IC2.4 15.37,29.06 19.3,29.06 19.84,28.52 41.26,28.52 44.12,31.37 45.95,31.37 46.93,32.35 U$1.19
SWCLK/TCK  (via drill 0.3 pad 0.61)
  Top 0.305: v31.68,51.95 32.74,53.01 51.4,53.01 51.55,53.16 64.16,53.16 v65.18,52.15
  Bottom 0.305: v31.68,51.95 30.21,50.48 30.21,42.15 24.07,36.01 U$1.10 | v65.18,52.15 82.81,52.15 90.54,44.42 90.54,35.87 94.66,31.75 PROG.2
SWDIO/TMS  (via drill 0.3 pad 0.61)
  Top 0.305: v51,37.92 50.12,37.04 27.64,37.04 26.61,36.01 U$1.11 | PROG.3 93.45,33.68 57.92,33.68 57.13,34.47 v57.13,34.92
  Bottom 0.305: v57.13,34.92 57.13,35.55 54.76,37.92 v51,37.92
TX1  (via drill 0.3 pad 0.61)
  Top 0.305: v57.95,34.51 72.34,34.51 80.54,42.71 89.38,42.71 93.54,38.55 HMMOD-UART.6
  Bottom 0.305: v57.95,34.51 57.76,34.31 56.79,34.31 55.17,35.93 55.17,36.83 UART1.2 52.43,36.83 51.51,36.83 51.22,36.83 50.15,37.89 50.15,42.81 45.36,47.61 44.39,47.61 U$1.23
TX-MAPLE
  Top 0.305: UART0.2 51.51,46.99 50.44,45.92 47.31,45.92 43.14,41.76 42.75,41.76 42.09,42.42 42.09,42.82 37.76,47.15 26.34,47.15 U$1.31
TX_DBG  (via drill 0.3 pad 0.61)
  Top 0.305: WLAN.RX 59.82,45.53 51.58,45.53 51.01,44.96 47.31,44.96 42.68,40.34 v37.21,40.34 | v88.67,45.37 95.61,45.37 95.96,45.72 DBG.3
  Bottom 0.305: v37.21,40.34 36.77,39.9 U$1.15 | WLAN.RX 68.25,38.05 75.57,45.37 v88.67,45.37
V1W  (via drill 0.3 pad 0.61)
  Top 0.61: v22.3,12.47 6,12.47 5.08,11.56 J2.1
  Bottom 0.61: 22.3,5.08 22.02,4.8 | 22.3,5.08 22.71,5.08 R4.2 | 22.3,5.08 v22.3,12.47 23.16,13.34 23.93,13.34 | 22.02,4.8 21.55,4.33 21.55,4 21.59,3.96 JP1.2 | 22.02,4.8 21.74,5.08 R1.1 | 23.93,13.34 25.09,14.49 R2.1 | IC3.1 23.93,13.34
VCC  (via drill 0.3 pad 0.61)  (2 unrouted)
  Top 0.61: UART0.1 59.99,44.45 65.88,38.56 65.88,36.78 | 29.93,22.15 31.13,20.95 v44.53,20.95 | 29.24,20.94 | 29.24,20.94 29.16,20.86 23.74,20.86 23.55,21.06 14.33,21.06 U$1.1 3.67,36.64 9.5,36.64 9.97,37.12 9.97,47.45 | CC2-EXT.VCC@0 CC2-EXT.VCC@1 | 85.43,30.47 82.46,27.49 71.97,27.49 CC3.VCC | 29.93,22.15 CC0.VCC 29.24,20.94 | 29.93,22.67 | 29.93,22.67 29.93,22.15 | C1.2 29.93,22.67 | PROG.4 97.18,26.19 94.01,26.19 | C5.+ 80.38,33.01 84.41,33.01 85.43,31.99 85.43,30.47 | 85.43,30.47 89.73,30.47 94.01,26.19 | CC1.VCC 94.01,26.19 | IC2.11 IC2.10 | 9.97,47.45 10.1,47.57 10.1,51.75 IC2.11 | 65.88,36.78 57.81,36.78 55.32,34.29 UART1.1 53.34,28.98 52.94,28.57 C7.- | 9.97,47.45 3.18,47.45 U$1.40 | C6.1 10.22,54.53 10.29,54.46 IC2.11 | 65.88,36.78 66.03,36.78 WLAN.VCC | C12.1 83.63,40.45 83.54,40.35 HMMOD-UART.1
  Bottom 0.61: 78.61,31.46 82.32,35.17 83.54,35.17 HMMOD-UART.1 | C5.+ 78.61,31.46 | 78.61,31.46 70.31,31.46 CC2-EXT.VCC@0 69.09,32.68 67.3,34.48 WLAN.VCC 66.07,36.73 66.07,40.12 65.3,40.89 CHPD1.2 | 51.96,20.47 52.24,20.47 53.34,21.57 UART1.1 | 51.96,20.47 51.96,17.27 VTRX2.1 | 51.96,20.47 51.48,20.95 v44.53,20.95 | DBG.2 95.78,41.17 95.78,40.09 99.35,36.51 99.35,28.36 PROG.4
VIN
  Bottom 0.61: U$2.TIP 14.38,21.18 14.53,21.34 F1.P$2 17.47,21.34 17.73,21.59 NO_FUSE.2
VIN2  (via drill 0.3 pad 0.61)
  Top 0.61: 49.79,49.1 47.23,46.54 47.06,46.54 v42.96,42.44 | 49.79,49.1 50.62,48.27 84.68,48.27 92.31,40.64 DBG.1 | U$1.21 49.79,49.1
  Bottom 0.61: 37.06,18.83 37.06,20.42 43.12,26.48 43.12,42.29 v42.96,42.44 | JP1.1 20.57,0.81 24.63,0.81 32.02,8.2 32.02,16.66 34.2,18.83 37.06,18.83 | 37.06,18.83 NO_REGULATOR.1 37.06,15.57 IC6.2 1117.4 IC6.TAB
WIZ_CS
  Top 0.305: U$1.20 49.47,36.01 46.44,36.01 45.82,35.39 45.82,33.31 44.5,31.99 26.89,31.99 23.93,29.04 20,29.04 17.91,31.13 IC2.5
WIZ_RST
  Bottom 0.305: IC2.8 17.91,54.51 31.44,54.51 35.5,50.46 35.5,42.93 39.31,39.12 39.31,36.01 U$1.16

### Text on the board
tNames: MAPLE CUN / - large - | GND | CS | VCC | GND | T | GND | R | R | VCC | T | + | GND | VIN | TX | TX | RX | RX | 31 | VCC | GND | CLK | GND | DIO | LAN | C7 | VCC | + | + | + | GND | 1W | + | + | 1W | GND | Ant3 | Ant1 | Ant2 | 1W | Ant4
bNames: WLAN from Seeedstudio... | Socket CC1101 / TRX. 3 | Fuse | C9 | R2 | 1W | Version 3.5 / www.neuby.de | MAPLE CUN | DS2482 | BSS84 | R4 | R1 | R4 | Ant1 | VIN | Ant3 | Ant4 | Ant2 | R1